# EAGLE design VID28_board_0001 (EAGLE 9.5.2)
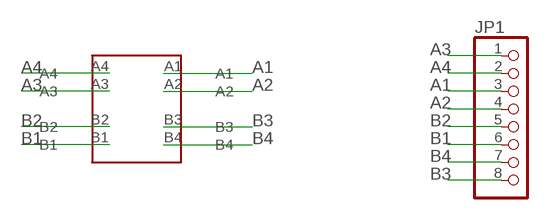
[diagram p0: schematic, sheet 1]

## Parts
CLOCK  VID28-05  [VID28-05]
JP1  PINHD-1X8  [1X08]

## Nets
A1: CLOCK.A1 JP1.3
A2: CLOCK.A2 JP1.4
A3: CLOCK.A3 JP1.1
A4: CLOCK.A4 JP1.2
B1: CLOCK.B1 JP1.6
B2: CLOCK.B2 JP1.5
B3: CLOCK.B3 JP1.8
B4: CLOCK.B4 JP1.7

## Library data of the parts
CLOCK = vd28-05:VID28-05: VID28-05 Stepper Motor With Dual Coaxial Shafts Designed for automotive dashboards.
JP1 = pinhead:PINHD-1X8: PIN HEADER

## Board
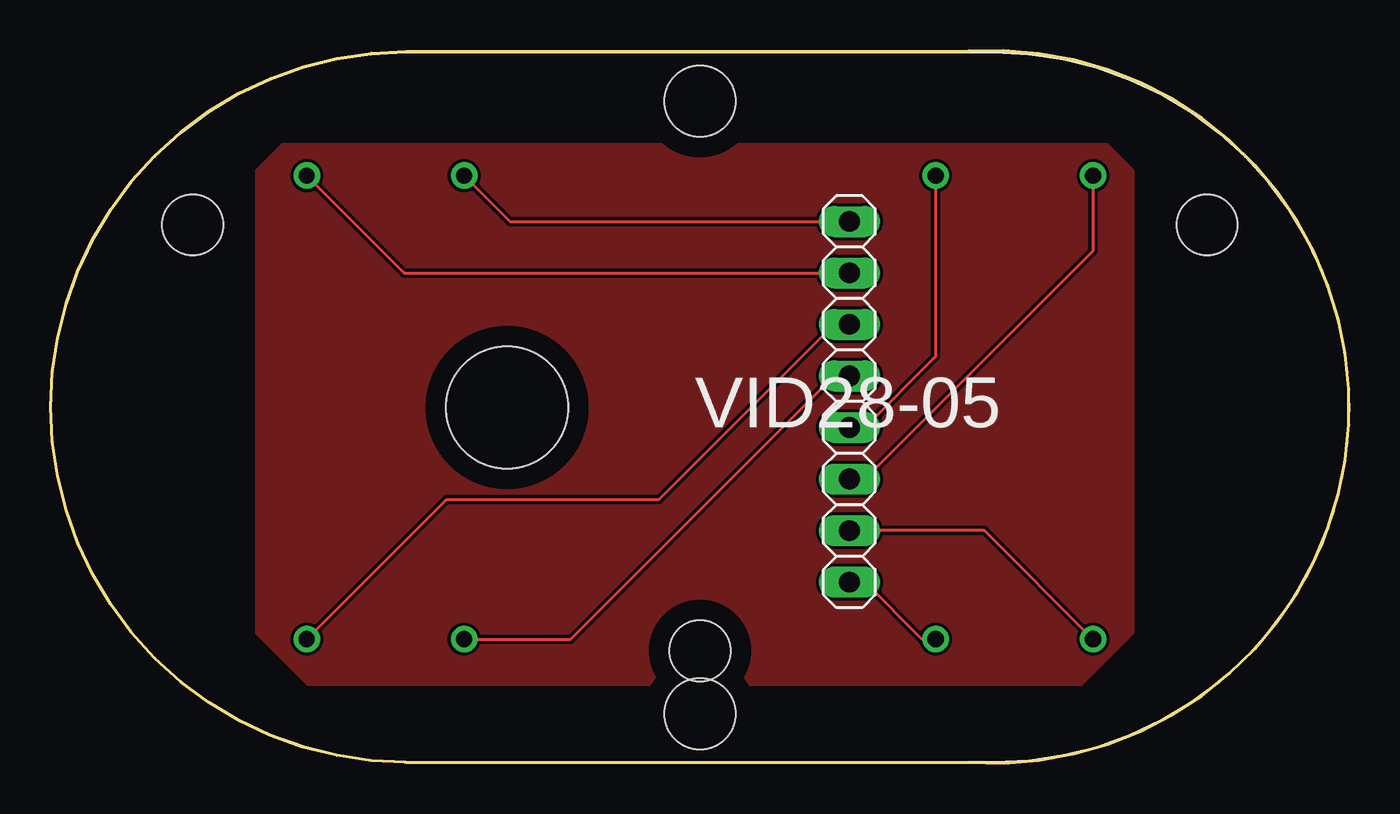
[diagram p1: board, top side]

Size 63.98 x 35.12 mm. Coordinates in mm from the lower left corner, seen from the top.
Outline: 17.53,0.04 arc-180 17.53,35.09 45.21,35.09 arc-188 45.21,0.04 17.53,0.04
Copper layers (1*16): Top 0.035mm / dielectric 1.5mm / Bottom 0.035mm
Design rules "default": minimum track width 6mil, minimum drill 0.35mm, track to track 6mil, track to pad 6mil, pad to pad 6mil, via to via 6mil, smd to smd 6mil, copper to edge 40mil, drill to drill 6mil, minimum pad ring 10mil, minimum via ring 8mil, stop-mask expansion 4mil, vias tented up to drill 0mil, thermal gap 10mil

### Footprints (pad centres in the part's own frame; a part is rotated, then mirrored left to right if it is on the bottom)
VID28-05 = drill 0.8: A1 12.621,6.071; A2 20.381,6.071; A3 20.381,28.931; A4 12.621,28.931; B1 51.379,28.931; B2 43.619,28.931; B3 43.619,6.071; B4 51.379,6.071 | hole 3: 7,26.5; 32.001,5.499; 57,26.5 | hole 6: 22.499,17.5 | hole 3.5: 31.999,2.4; 31.999,32.601
1X08 = drill 1.016 long: 1 -8.89,0; 2 -6.35,0; 3 -3.81,0; 4 -1.27,0; 5 1.27,0; 6 3.81,0; 7 6.35,0; 8 8.89,0

### Placement (x,y rotation side)
CLOCK  0,0.04 0 top
JP1  39.37,17.82 270 top

### Tracks (layer width: path | path; a pad name or v marks a point on that pad's centre or on a via)
A1
  Top 0.152: CLOCK.A1 19.51,12.99 29.97,12.99 38.61,21.63 JP1.3
A2
  Top 0.152: CLOCK.A2 25.63,6.11 38.61,19.09 JP1.4
A3
  Top 0.152: CLOCK.A3 22.64,26.71 38.61,26.71 JP1.1
A4
  Top 0.152: CLOCK.A4 17.42,24.17 38.61,24.17 JP1.2
B1
  Top 0.152: CLOCK.B1 51.38,25.25 40.13,14.01 JP1.6
B2
  Top 0.152: CLOCK.B2 43.62,20.03 40.13,16.55 JP1.5
B3
  Top 0.152: CLOCK.B3 42.95,6.11 40.13,8.93 JP1.8
B4
  Top 0.152: CLOCK.B4 46.02,11.47 40.13,11.47 JP1.7
GND
  pour Top: 10.16,6.39 10.16,29.25 11.43,30.52 52.07,30.52 53.34,29.25 53.34,6.39 50.8,3.85 12.7,3.85